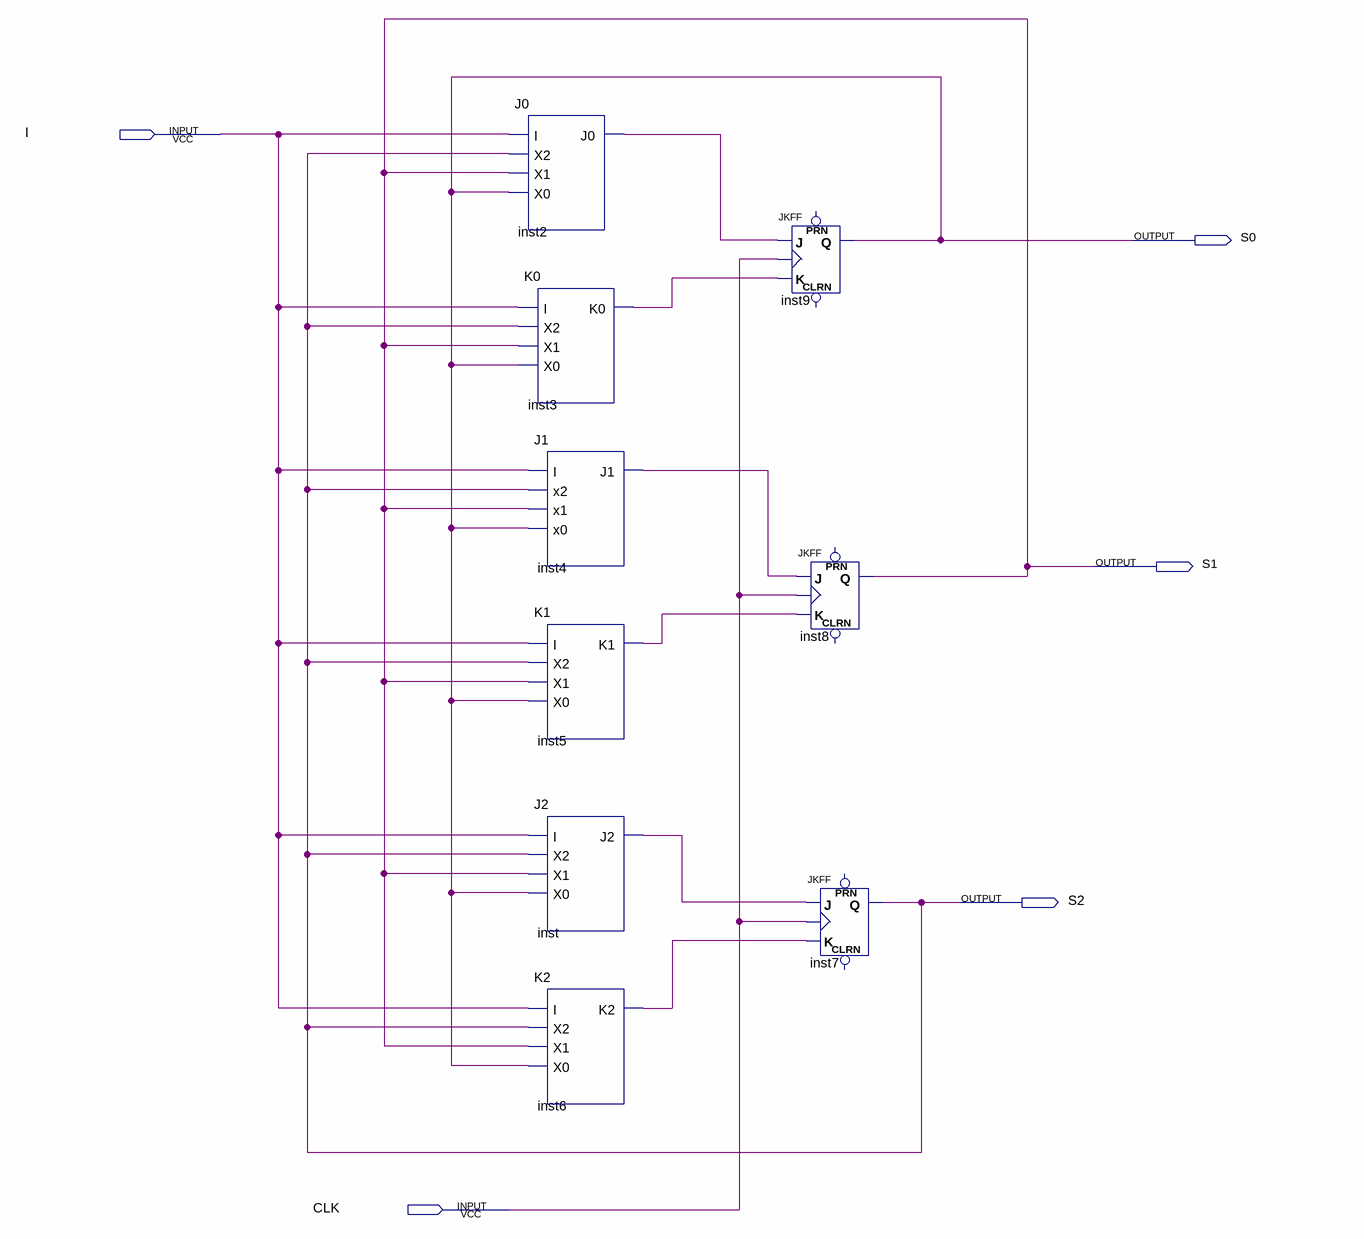
[diagram p0: schematic sheet]
// Quartus schematic detector.bdf as structural Verilog: 9 symbols, 5 pins
module detector (
  input  I,
  input  CLK,
  output S0,
  output S1,
  output S2
);

  wire inst2_j0, inst3_k0, inst4_j1, inst5_k1, inst6_k2, inst_j2;

  J0 inst2 (.I(I), .X2(S2), .X1(S1), .X0(S0), .J0(inst2_j0));
  K0 inst3 (.I(I), .X2(S2), .X1(S1), .X0(S0), .K0(inst3_k0));
  J1 inst4 (.I(I), .x2(S2), .x1(S1), .x0(S0), .J1(inst4_j1));
  K1 inst5 (.I(I), .X2(S2), .X1(S1), .X0(S0), .K1(inst5_k1));
  J2 inst (.I(I), .X2(S2), .X1(S1), .X0(S0), .J2(inst_j2));
  K2 inst6 (.I(I), .X2(S2), .X1(S1), .X0(S0), .K2(inst6_k2));
  JKFF inst9 (.K(inst3_k0), .J(inst2_j0), .CLK(CLK), .Q(S0));  // open: PRN, CLRN
  JKFF inst8 (.K(inst5_k1), .J(inst4_j1), .CLK(CLK), .Q(S1));  // open: PRN, CLRN
  JKFF inst7 (.K(inst6_k2), .J(inst_j2), .CLK(CLK), .Q(S2));  // open: PRN, CLRN
endmodule
